# Altium project RP2350A Breakout Board.PrjPcb
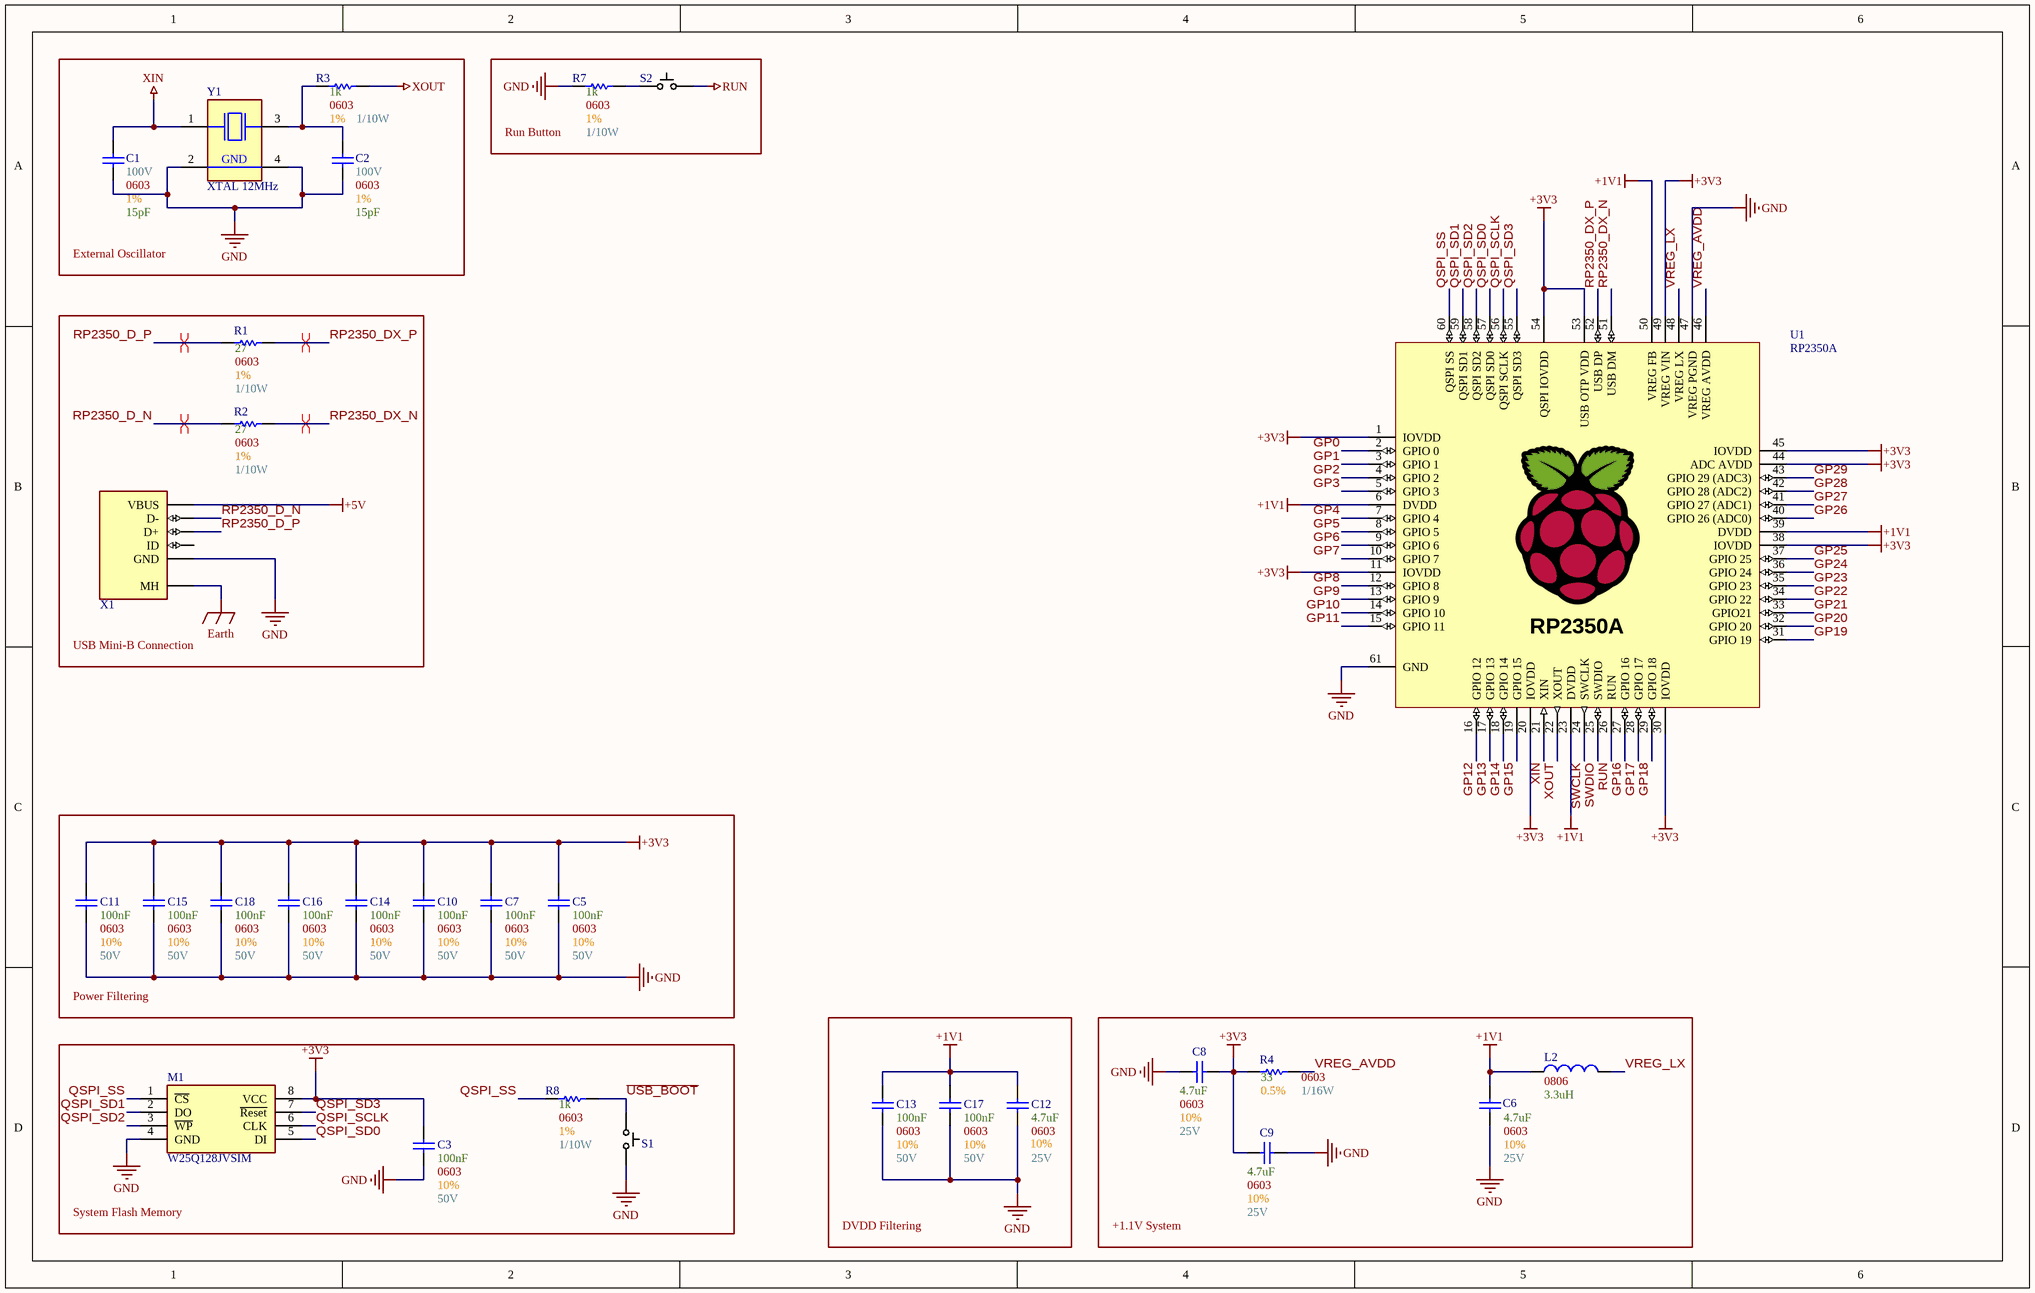
[diagram p0: RP2350A.SchDoc]
2 sheets, 35 parts. Net scope: global (net labels, ports and power ports of the same name join across sheets).
Board file: Main.PcbDoc
Sheets:
  RP2350A.SchDoc
  Pin Connections.SchDoc

## Sheet RP2350A.SchDoc
size B; SheetNumber: 1; SheetTotal: 3

### Parts
C1  Max Voltage: 100V  Size Package: 0603  Tolerance: 1%  Capacitance: 15pF  [[Cap] SMD 0603]  (hidden comment: [Cap] 0603 15pF 1% 100V)
C2  Max Voltage: 100V  Size Package: 0603  Tolerance: 1%  Capacitance: 15pF  [[Cap] SMD 0603]  (hidden comment: [Cap] 0603 15pF 1% 100V)
C3  Max Voltage: 50V  Size Package: 0603  Tolerance: 10%  Capacitance: 100nF  [[Cap] SMD 0603]  (hidden comment: [Cap] 0603 0.1uF 10% 50V)
C5  Max Voltage: 50V  Size Package: 0603  Tolerance: 10%  Capacitance: 100nF  [[Cap] SMD 0603]  (hidden comment: [Cap] 0603 0.1uF 10% 50V)
C6  Max Voltage: 25V  Size Package: 0603  Tolerance: 10%  Capacitance: 4.7uF  [[Cap] SMD 0603]  (hidden comment: [Cap] 0603 4.7uF 10% 25V)
C7  Max Voltage: 50V  Size Package: 0603  Tolerance: 10%  Capacitance: 100nF  [[Cap] SMD 0603]  (hidden comment: [Cap] 0603 0.1uF 10% 50V)
C8  Max Voltage: 25V  Size Package: 0603  Tolerance: 10%  Capacitance: 4.7uF  [[Cap] SMD 0603]  (hidden comment: [Cap] 0603 4.7uF 10% 25V)
C9  Max Voltage: 25V  Size Package: 0603  Tolerance: 10%  Capacitance: 4.7uF  [[Cap] SMD 0603]  (hidden comment: [Cap] 0603 4.7uF 10% 25V)
C10  Max Voltage: 50V  Size Package: 0603  Tolerance: 10%  Capacitance: 100nF  [[Cap] SMD 0603]  (hidden comment: [Cap] 0603 0.1uF 10% 50V)
C11  Max Voltage: 50V  Size Package: 0603  Tolerance: 10%  Capacitance: 100nF  [[Cap] SMD 0603]  (hidden comment: [Cap] 0603 0.1uF 10% 50V)
C12  Max Voltage: 25V  Size Package: 0603  Tolerance: 10%  Capacitance: 4.7uF  [[Cap] SMD 0603]  (hidden comment: [Cap] 0603 4.7uF 10% 25V)
C13  Max Voltage: 50V  Size Package: 0603  Tolerance: 10%  Capacitance: 100nF  [[Cap] SMD 0603]  (hidden comment: [Cap] 0603 0.1uF 10% 50V)
C14  Max Voltage: 50V  Size Package: 0603  Tolerance: 10%  Capacitance: 100nF  [[Cap] SMD 0603]  (hidden comment: [Cap] 0603 0.1uF 10% 50V)
C15  Max Voltage: 50V  Size Package: 0603  Tolerance: 10%  Capacitance: 100nF  [[Cap] SMD 0603]  (hidden comment: [Cap] 0603 0.1uF 10% 50V)
C16  Max Voltage: 50V  Size Package: 0603  Tolerance: 10%  Capacitance: 100nF  [[Cap] SMD 0603]  (hidden comment: [Cap] 0603 0.1uF 10% 50V)
C17  Max Voltage: 50V  Size Package: 0603  Tolerance: 10%  Capacitance: 100nF  [[Cap] SMD 0603]  (hidden comment: [Cap] 0603 0.1uF 10% 50V)
C18  Max Voltage: 50V  Size Package: 0603  Tolerance: 10%  Capacitance: 100nF  [[Cap] SMD 0603]  (hidden comment: [Cap] 0603 0.1uF 10% 50V)
L2  Package: 0806  Inductance: 3.3uH  [[Inductor] SMD 0806]  (hidden comment: [3.3uH] SMD 0806 2.1A)
M1  W25Q128JVSIM  [[Flash] 128MBit]
R1  Wattage: 1/10W  Tolerance: 1%  Resistance: 27  Size Package: 0603  [[Res] SMD 0603]  (hidden comment: [27] SMD 0603 1% 1/10W)
R2  Wattage: 1/10W  Tolerance: 1%  Resistance: 27  Size Package: 0603  [[Res] SMD 0603]  (hidden comment: [27] SMD 0603 1% 1/10W)
R3  Wattage: 1/10W  Tolerance: 1%  Resistance: 1k  Size Package: 0603  [[Res] SMD 0603]  (hidden comment: [1k] SMD 0603 1% 1/10W)
R4  Wattage: 1/16W  Tolerance: 0.5%  Resistance: 33  Size Package: 0603  [[Res] SMD 0603]  (hidden comment: [33] SMD 0603 0.5% 1/16W)
R7  Wattage: 1/10W  Tolerance: 1%  Resistance: 1k  Size Package: 0603  [[Res] SMD 0603]  (hidden comment: [1k] SMD 0603 1% 1/10W)
R8  Wattage: 1/10W  Tolerance: 1%  Resistance: 1k  Size Package: 0603  [[Res] SMD 0603]  (hidden comment: [1k] SMD 0603 1% 1/10W)
S1  [SPST] SMD Pushbutton  [[SPST] SMD Pushbutton]  (value not drawn)
S2  [SPST] SMD Pushbutton  [[SPST] SMD Pushbutton]  (value not drawn)
U1  RP2350A  [[MCU] RP2350A]
X1  [USB] Type-B Mini  [[USB] Type-B Mini]  (value not drawn)
Y1  XTAL 12MHz  [[Crystal] SMD 12MHz]

### Blocks framed on the sheet
External Oscillator: C1 C2 R3 Y1
Run Button: R7 S2
USB Mini-B Connection: R1 R2 X1
Power Filtering: C5 C7 C10 C11 C14-C16 C18
DVDD Filtering: C12 C13 C17
+1.1V System: C6 C8 C9 L2 R4
System Flash Memory: C3 M1 R8 S1

### Nets
+1V1: C6.1 C12.2 C13.2 C17.2 L2.1 U1.6(DVDD) U1.23(DVDD) U1.39(DVDD) U1.50(VREG_FB)
+3V3: C3.2 C5.2 C7.2 C8.1 C9.2 C10.2 C11.2 C14.2 C15.2 C16.2 C18.2 M1.8(VCC) R4.1 U1.1(IOVDD) U1.11(IOVDD) U1.20(IOVDD) U1.30(IOVDD) U1.38(IOVDD) U1.44(ADC_AVDD) U1.45(IOVDD) U1.49(VREG_VIN) U1.53(USB_OTP_VDD) U1.54(QSPI_IOVDD)
+5V: X1.1(VBUS)
Earth: X1.MH
GND: C1.1 C2.1 C3.1 C5.1 C6.2 C7.1 C8.2 C9.1 C10.1 C11.1 C12.1 C13.1 C14.1 C15.1 C16.1 C17.1 C18.1 M1.4(GND) R7.1 S1.2 U1.47(VREG_PGND) U1.61(GND) X1.5(GND) Y1.2(GND) Y1.4(GND)
RUN: S2.2 U1.26(RUN)
XIN: C1.2 U1.21(XIN) Y1.1(XTAL1)
XOUT: R3.2 U1.22(XOUT)
GP0: U1.2(GPIO_0)
GP1: U1.3(GPIO_1)
GP2: U1.4(GPIO_2)
GP3: U1.5(GPIO_3)
GP4: U1.7(GPIO_4)
GP5: U1.8(GPIO_5)
GP6: U1.9(GPIO_6)
GP7: U1.10(GPIO_7)
GP8: U1.12(GPIO_8)
GP9: U1.13(GPIO_9)
GP10: U1.14(GPIO_10)
GP11: U1.15(GPIO_11)
GP12: U1.16(GPIO_12)
GP13: U1.17(GPIO_13)
GP14: U1.18(GPIO_14)
GP15: U1.19(GPIO_15)
GP16: U1.27(GPIO_16)
GP17: U1.28(GPIO_17)
GP18: U1.29(GPIO_18)
GP19: U1.31(GPIO_19)
GP20: U1.32(GPIO_20)
GP21: U1.33(GPIO21)
GP22: U1.34(GPIO_22)
GP23: U1.35(GPIO_23)
GP24: U1.36(GPIO_24)
GP25: U1.37(GPIO_25)
GP26: U1.40(GPIO_26_(ADC0))
GP27: U1.41(GPIO_27_(ADC1))
GP28: U1.42(GPIO_28_(ADC2))
GP29: U1.43(GPIO_29_(ADC3))
QSPI_SCLK: M1.6(CLK) U1.56(QSPI_SCLK)
QSPI_SD0: M1.5(DI) U1.57(QSPI_SD0)
QSPI_SD1: M1.2(DO) U1.59(QSPI_SD1)
QSPI_SD2: M1.3(~{WP}) U1.58(QSPI_SD2)
QSPI_SD3: M1.7(~{Reset}) U1.55(QSPI_SD3)
QSPI_SS: M1.1(~{CS}) R8.1 U1.60(QSPI_SS)
RP2350_D_N: R2.1 X1.2(D-)
RP2350_D_P: R1.1 X1.3(D+)
RP2350_DX_N: R2.2 U1.51(USB_DM)
RP2350_DX_P: R1.2 U1.52(USB_DP)
SWCLK: U1.24(SWCLK)
SWDIO: U1.25(SWDIO)
~{USB_BOOT}: R8.2 S1.1
VREG_AVDD: R4.2 U1.46(VREG_AVDD)
VREG_LX: L2.2 U1.48(VREG_LX)
NetC2_2: C2.2 R3.1 Y1.3(XTAL2)
NetR7_2: R7.2 S2.1

Not connected (* = marked no-connect by the designer): X1 4(ID)

### Layout directives
differential pair; differential pair class USB_Pairs: RP2350_D_N, RP2350_D_P, RP2350_DX_N, RP2350_DX_P

### Library data of the parts
C1 C2 = [Cap] 0603 15pF 1% 100V: GCM1885C2A150FA16D; Supplier 1: DigiKey; Supplier Part Number 1: 490-16416-1-ND
C3 C5 C7 C10 C11 C13-C18 = [Cap] 0603 0.1uF 10% 50V: CL10B104KB8NNNC; Supplier 1: DigiKey; Supplier Part Number 1: 1276-1000-6-ND
C6 C8 C9 C12 = [Cap] 0603 4.7uF 10% 25V: GRM188R61E475KE11D; Supplier 1: DigiKey; Supplier Part Number 1: 490-7203-6-ND
L2 = [3.3uH] SMD 0806 2.1A: AOTA-B201610S3R3-101-T; Supplier 1: DigiKey; Supplier Part Number 1: 535-AOTA-B201610S3R3-101-TCT-ND
M1 = [Flash] 128MBit: Supplier 1: DigiKey; Supplier Part Number 1: W25Q128JVSIM-ND
R1 R2 = [27] SMD 0603 1% 1/10W: MCT06030C2709FP500; Supplier 1: DigiKey; Supplier Part Number 1: 749-1631-1-ND
R3 R7 R8 = [1k] SMD 0603 1% 1/10W: RMCF0603FT1K00; Supplier 1: DigiKey; Supplier Part Number 1: RMCF0603FT1K00DKR-ND
R4 = [33] SMD 0603 0.5% 1/16W: RR0816Q-330-D; Supplier 1: DigiKey; Supplier Part Number 1: RR08Q33DDKR-ND
S1 S2 = [SPST] SMD Pushbutton: PTS815SJM250SMTRLFS; Supplier 1: DigiKey; Supplier Part Number 1: CKN12215-6-ND
U1 = [MCU] RP2350A: QFN-60 Package; Supplier 1: DigiKey; Supplier Part Number 1: 2648-SC1509-A4CT-ND
X1 = [USB] Type-B Mini: MUSB-05-S-B-SM-A-K-TR; Supplier 1: DigiKey; Supplier Part Number 1: SAM14226CT-ND
Y1 = [Crystal] SMD 12MHz: 815-ABM8-272-T3; Supplier 1: DigiKey; Supplier Part Number 1: 535-ABM8-272-T3CT-ND

## Sheet Pin Connections.SchDoc
size A; SheetNumber: 3; SheetTotal: 3
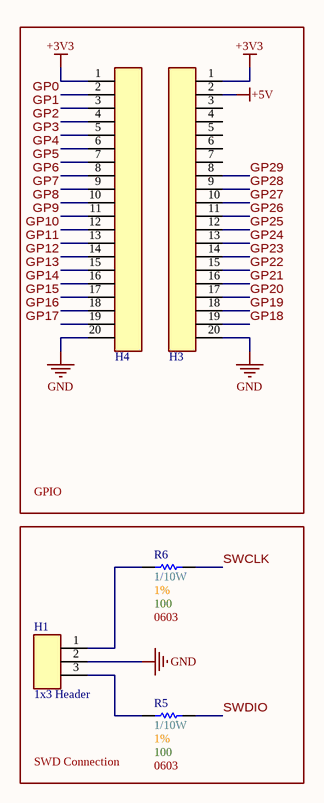
[diagram p1: Pin Connections.SchDoc]

### Parts
H1  1x3 Header  [[Header] 1x3 Male]
H3  1x20 Header  [[Header] 1x20 Male]  (value not drawn)
H4  1x20 Header  [[Header] 1x20 Male]  (value not drawn)
R5  Wattage: 1/10W  Tolerance: 1%  Resistance: 100  Size Package: 0603  [[Res] SMD 0603]  (hidden comment: [100] SMD 0603 1% 1/10W)
R6  Wattage: 1/10W  Tolerance: 1%  Resistance: 100  Size Package: 0603  [[Res] SMD 0603]  (hidden comment: [100] SMD 0603 1% 1/10W)

### Blocks framed on the sheet
GPIO: H3 H4
SWD Connection: H1 R5 R6

### Nets
+3V3: H3.1 H4.1
+5V: H3.2
GND: H1.2 H3.20 H4.20
GP0: H4.2
GP1: H4.3
GP2: H4.4
GP3: H4.5
GP4: H4.6
GP5: H4.7
GP6: H4.8
GP7: H4.9
GP8: H4.10
GP9: H4.11
GP10: H4.12
GP11: H4.13
GP12: H4.14
GP13: H4.15
GP14: H4.16
GP15: H4.17
GP16: H4.18
GP17: H4.19
GP18: H3.19
GP19: H3.18
GP20: H3.17
GP21: H3.16
GP22: H3.15
GP23: H3.14
GP24: H3.13
GP25: H3.12
GP26: H3.11
GP27: H3.10
GP28: H3.9
GP29: H3.8
SWCLK: R6.2
SWDIO: R5.2
NetH1_1: H1.1 R6.1
NetH1_3: H1.3 R5.1

Not connected (* = marked no-connect by the designer): H3 3 4 5 6 7

### Library data of the parts
H1 = [Header] 1x3 Male: 2.54mm pitch
H3 H4 = [Header] 1x20 Male: 2.54mm pitch
R5 R6 = [100] SMD 0603 1% 1/10W: RC0603FR-07100RL; Supplier 1: DigiKey; Supplier Part Number 1: 311-100HRDKR-ND

## Nets that join several sheets
+3V3: RP2350A (23 pins), Pin Connections (H3.1 H4.1)
+5V: RP2350A (X1.1), Pin Connections (H3.2)
GND: RP2350A (25 pins), Pin Connections (H1.2 H3.20 H4.20)
GP0: RP2350A (U1.2), Pin Connections (H4.2)
GP1: RP2350A (U1.3), Pin Connections (H4.3)
GP2: RP2350A (U1.4), Pin Connections (H4.4)
GP3: RP2350A (U1.5), Pin Connections (H4.5)
GP4: RP2350A (U1.7), Pin Connections (H4.6)
GP5: RP2350A (U1.8), Pin Connections (H4.7)
GP6: RP2350A (U1.9), Pin Connections (H4.8)
GP7: RP2350A (U1.10), Pin Connections (H4.9)
GP8: RP2350A (U1.12), Pin Connections (H4.10)
GP9: RP2350A (U1.13), Pin Connections (H4.11)
GP10: RP2350A (U1.14), Pin Connections (H4.12)
GP11: RP2350A (U1.15), Pin Connections (H4.13)
GP12: RP2350A (U1.16), Pin Connections (H4.14)
GP13: RP2350A (U1.17), Pin Connections (H4.15)
GP14: RP2350A (U1.18), Pin Connections (H4.16)
GP15: RP2350A (U1.19), Pin Connections (H4.17)
GP16: RP2350A (U1.27), Pin Connections (H4.18)
GP17: RP2350A (U1.28), Pin Connections (H4.19)
GP18: RP2350A (U1.29), Pin Connections (H3.19)
GP19: RP2350A (U1.31), Pin Connections (H3.18)
GP20: RP2350A (U1.32), Pin Connections (H3.17)
GP21: RP2350A (U1.33), Pin Connections (H3.16)
GP22: RP2350A (U1.34), Pin Connections (H3.15)
GP23: RP2350A (U1.35), Pin Connections (H3.14)
GP24: RP2350A (U1.36), Pin Connections (H3.13)
GP25: RP2350A (U1.37), Pin Connections (H3.12)
GP26: RP2350A (U1.40), Pin Connections (H3.11)
GP27: RP2350A (U1.41), Pin Connections (H3.10)
GP28: RP2350A (U1.42), Pin Connections (H3.9)
GP29: RP2350A (U1.43), Pin Connections (H3.8)
SWCLK: RP2350A (U1.24), Pin Connections (R6.2)
SWDIO: RP2350A (U1.25), Pin Connections (R5.2)